# EasyEDA Pro project ProPrj_transverter-front-end_2026-04-14.epro, board PCB_PCB_inter-board-barrier
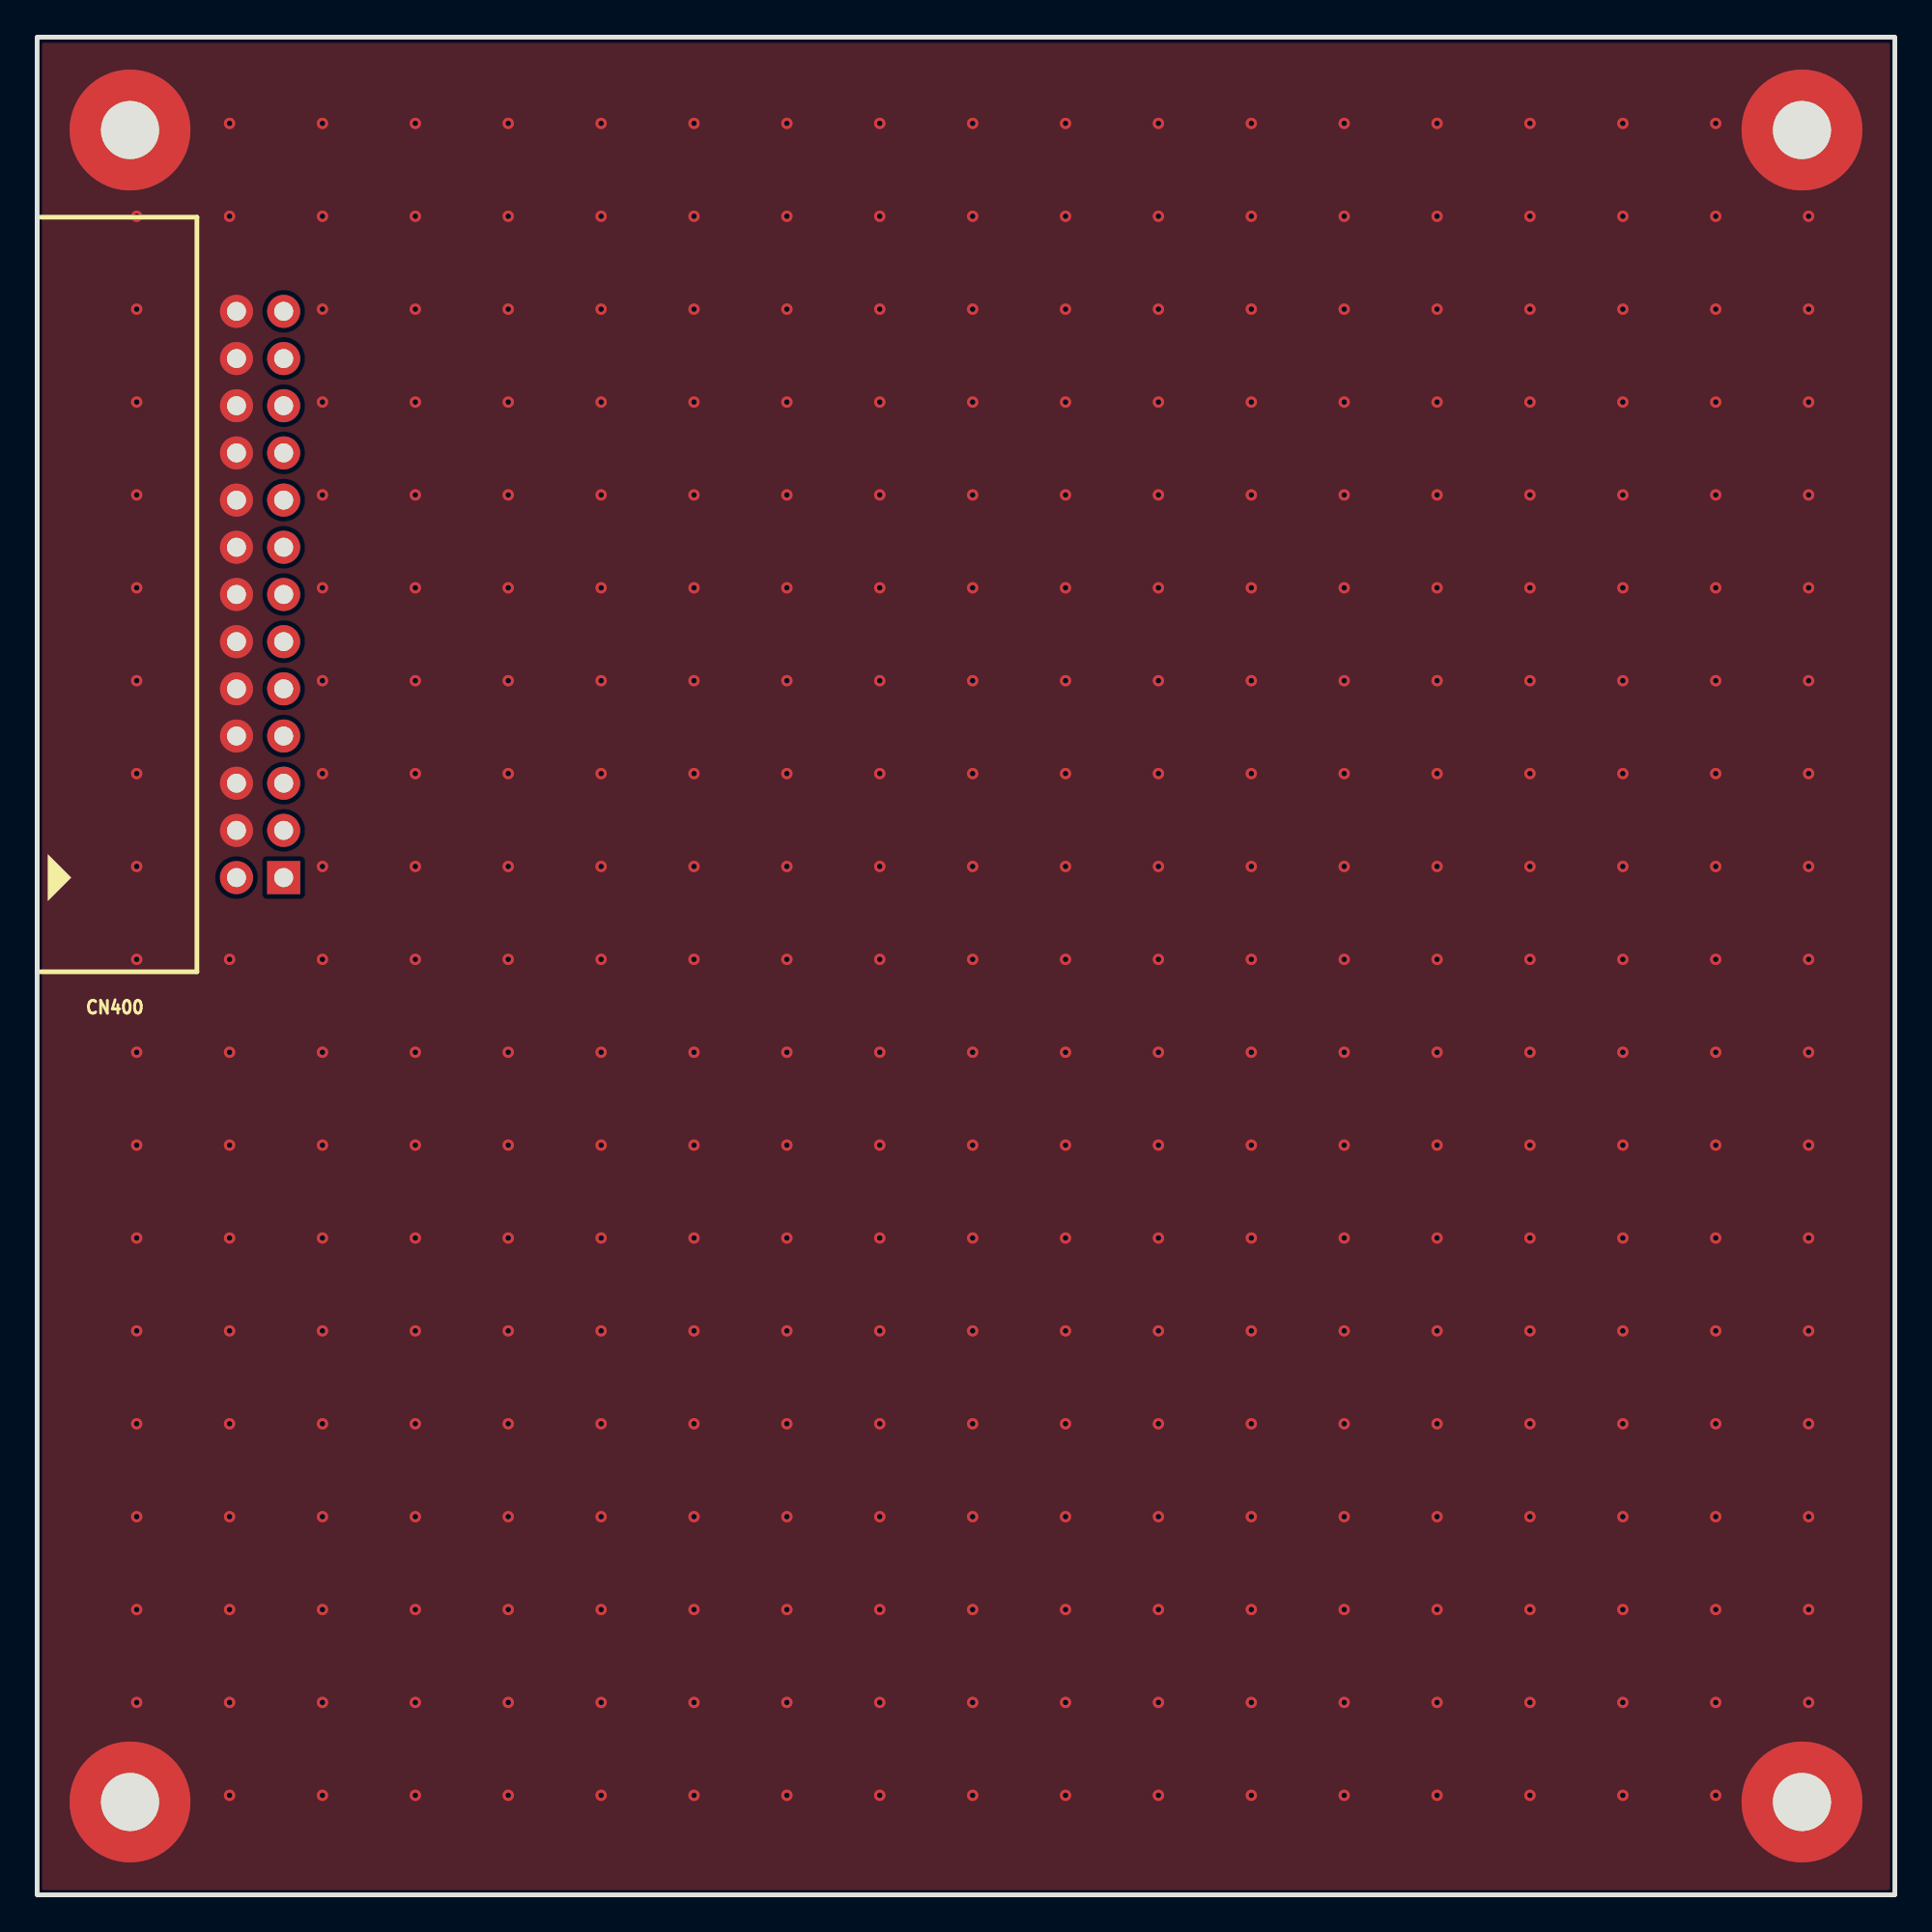
[diagram p13: board, top side]
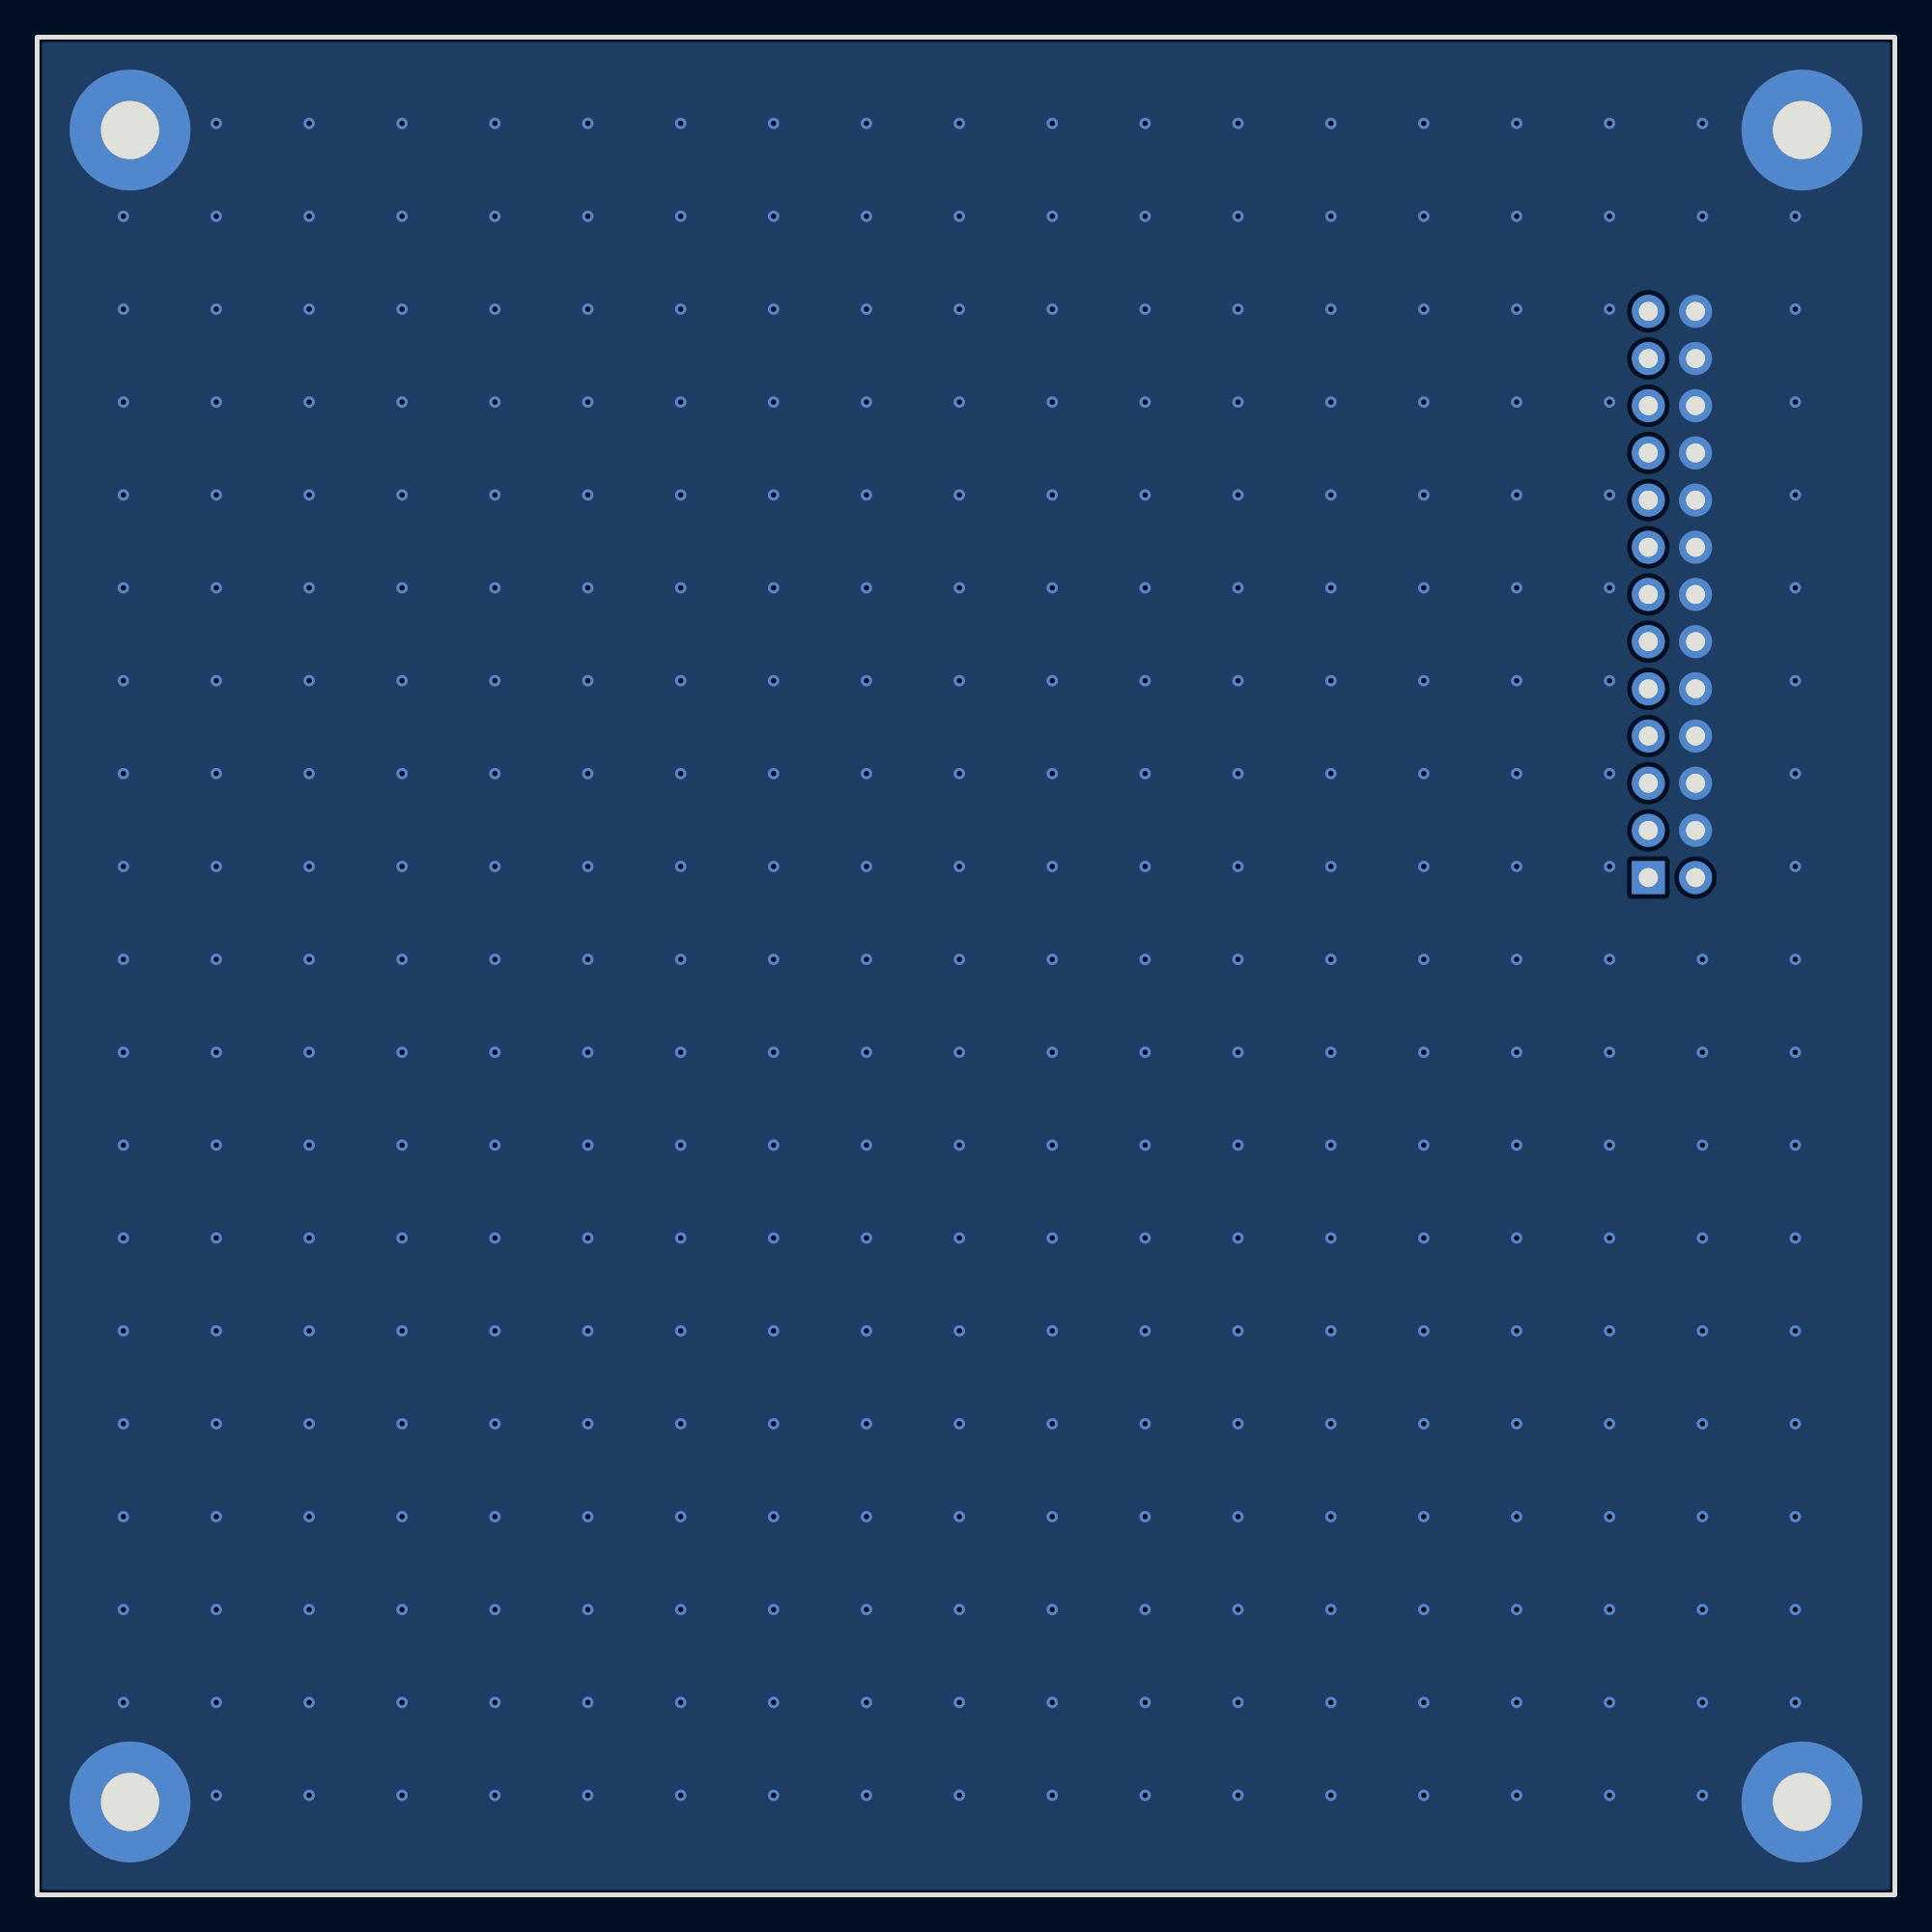
[diagram p14: board, bottom side, seen from below]

Outline 100 x 100 mm; copper layers: Top Layer, Bottom Layer. Coordinates in mm from the lower left corner of the outline.
Outline path: rectangle 0,100 100,0
Stack: Top Layer 0.035mm / Dielectric1 1.51mm FR4 er 4.5 / Bottom Layer 0.035mm

## Design rules (mm)
template: Custom Config
spacing copperThickness1oz (default): track to track 0.102, other pairs 0.152 to 0.3
spacing copperThickness2oz: track to track 0.203, other pairs 0.152 to 0.3
track width copperThickness1oz (default): min 0.127, default 0.254, max 2.54
track width copperThickness2oz: min 0.203, default 0.254, max 2.54
differential pair differentialPair (default): width min 0.127, default 0.254, max 2.54; gap min 0.152, default 0.152
via viaSize (default): diameter min 0.5, default 0.61, max 10; hole min 0.3, default 0.305, max 6.3
pour e5 uses copperRegion
pour e1 uses copperRegion

## Placement (name value [footprint] x y rotation side)
CN400  SBH11-PBPC-D13-RA-BK  [IDC-TH_26P-P2.54-H-M-R2-C13-W8.8]  12 70 270 top
NOREF  -  [Pad_e10]  5 5 0 top
NOREF#2  -  [Pad_e7]  5 95 0 top
NOREF#3  -  [Pad_e8]  95 95 0 top
NOREF#4  -  [Pad_e9]  95 5 0 top

## Footprints (pads in the part's own frame, mm; a bottom-side part is the same pattern mirrored in y, then rotated)
IDC-TH_26P-P2.54-H-M-R2-C13-W8.8
  rect 1.778x1.778 hole 1.02: 1(15.24,1.27)
  round 1.778 hole 1.02: 2(15.24,-1.27) 3(12.7,1.27) 4(12.7,-1.27) 5(10.16,1.27) 6(10.16,-1.27) 7(7.62,1.27) 8(7.62,-1.27) 9(5.08,1.27) 10(5.08,-1.27) 11(2.54,1.27) 12(2.54,-1.27) 13(0,1.27) 14(0,-1.27) 15(-2.54,1.27) 16(-2.54,-1.27) 17(-5.08,1.27) 18(-5.08,-1.27) 19(-7.62,1.27) 20(-7.62,-1.27) 21(-10.16,1.27) 22(-10.16,-1.27) 23(-12.7,1.27) 24(-12.7,-1.27) 25(-15.24,1.27) 26(-15.24,-1.27)
Pad_e7
  round 6.5 hole 3.125: 1(0,0)
Pad_e8
  round 6.5 hole 3.125: 2(0,0)
Pad_e9
  round 6.5 hole 3.125: 3(0,0)
Pad_e10
  round 6.5 hole 3.125: 4(0,0)

## Nets
GND: CN400.4 CN400.6 CN400.8 CN400.10 CN400.12 CN400.14 CN400.16 CN400.18 CN400.20 CN400.22 CN400.24 CN400.26 NOREF.4 NOREF#2.1 NOREF#3.2 NOREF#4.3

Pads without a net: CN400 1 2 3 5 7 9 11 13 15 17 19 21 23 25

## Via types
v1: diameter 0.61, hole 0.305, Top Layer to Bottom Layer, 350 vias

## Routing (per net, layer and track width the routed paths; a pad name or vN(x,y) marks a point on that pad's centre or on a via; arc(x,y) is an arc through that point)
GND:
  vias: v1(5.36,90.36) v1(5.36,85.36) v1(5.36,80.36) v1(5.36,75.36) v1(5.36,70.36) v1(5.36,65.36) v1(5.36,60.36) v1(5.36,55.36) v1(5.36,50.36) v1(5.36,45.36) v1(5.36,40.36) v1(5.36,35.36) v1(5.36,30.36) v1(5.36,25.36) v1(5.36,20.36) v1(5.36,15.36) v1(5.36,10.36) v1(10.36,95.36) v1(10.36,90.36) v1(10.36,50.36) v1(10.36,45.36) v1(10.36,40.36) v1(10.36,35.36) v1(10.36,30.36) v1(10.36,25.36) v1(10.36,20.36) v1(10.36,15.36) v1(10.36,10.36) v1(10.36,5.36) v1(15.36,95.36) v1(15.36,90.36) v1(15.36,85.36) v1(15.36,80.36) v1(15.36,75.36) v1(15.36,70.36) v1(15.36,65.36) v1(15.36,60.36) v1(15.36,55.36) v1(15.36,50.36) v1(15.36,45.36) v1(15.36,40.36) v1(15.36,35.36) v1(15.36,30.36) v1(15.36,25.36) v1(15.36,20.36) v1(15.36,15.36) v1(15.36,10.36) v1(15.36,5.36) v1(20.36,95.36) v1(20.36,90.36) v1(20.36,85.36) v1(20.36,80.36) v1(20.36,75.36) v1(20.36,70.36) v1(20.36,65.36) v1(20.36,60.36) v1(20.36,55.36) v1(20.36,50.36) v1(20.36,45.36) v1(20.36,40.36) v1(20.36,35.36) v1(20.36,30.36) v1(20.36,25.36) v1(20.36,20.36) v1(20.36,15.36) v1(20.36,10.36) v1(20.36,5.36) v1(25.36,95.36) v1(25.36,90.36) v1(25.36,85.36) v1(25.36,80.36) v1(25.36,75.36) v1(25.36,70.36) v1(25.36,65.36) v1(25.36,60.36) v1(25.36,55.36) v1(25.36,50.36) v1(25.36,45.36) v1(25.36,40.36) v1(25.36,35.36) v1(25.36,30.36) v1(25.36,25.36) v1(25.36,20.36) v1(25.36,15.36) v1(25.36,10.36) v1(25.36,5.36) v1(30.36,95.36) v1(30.36,90.36) v1(30.36,85.36) v1(30.36,80.36) v1(30.36,75.36) v1(30.36,70.36) v1(30.36,65.36) v1(30.36,60.36) v1(30.36,55.36) v1(30.36,50.36) v1(30.36,45.36) v1(30.36,40.36) v1(30.36,35.36) v1(30.36,30.36) v1(30.36,25.36) v1(30.36,20.36) v1(30.36,15.36) v1(30.36,10.36) v1(30.36,5.36) v1(35.36,95.36) v1(35.36,90.36) v1(35.36,85.36) v1(35.36,80.36) v1(35.36,75.36) v1(35.36,70.36) v1(35.36,65.36) v1(35.36,60.36) v1(35.36,55.36) v1(35.36,50.36) v1(35.36,45.36) v1(35.36,40.36) v1(35.36,35.36) v1(35.36,30.36) v1(35.36,25.36) v1(35.36,20.36) v1(35.36,15.36) v1(35.36,10.36) v1(35.36,5.36) v1(40.36,95.36) v1(40.36,90.36) v1(40.36,85.36) v1(40.36,80.36) v1(40.36,75.36) v1(40.36,70.36) v1(40.36,65.36) v1(40.36,60.36) v1(40.36,55.36) v1(40.36,50.36) v1(40.36,45.36) v1(40.36,40.36) v1(40.36,35.36) v1(40.36,30.36) v1(40.36,25.36) v1(40.36,20.36) v1(40.36,15.36) v1(40.36,10.36) v1(40.36,5.36) v1(45.36,95.36) v1(45.36,90.36) v1(45.36,85.36) v1(45.36,80.36) v1(45.36,75.36) v1(45.36,70.36) v1(45.36,65.36) v1(45.36,60.36) v1(45.36,55.36) v1(45.36,50.36) v1(45.36,45.36) v1(45.36,40.36) v1(45.36,35.36) v1(45.36,30.36) v1(45.36,25.36) v1(45.36,20.36) v1(45.36,15.36) v1(45.36,10.36) v1(45.36,5.36) v1(50.36,95.36) v1(50.36,90.36) v1(50.36,85.36) v1(50.36,80.36) v1(50.36,75.36) v1(50.36,70.36) v1(50.36,65.36) v1(50.36,60.36) v1(50.36,55.36) v1(50.36,50.36) v1(50.36,45.36) v1(50.36,40.36) v1(50.36,35.36) v1(50.36,30.36) v1(50.36,25.36) v1(50.36,20.36) v1(50.36,15.36) v1(50.36,10.36) v1(50.36,5.36) v1(55.36,95.36) v1(55.36,90.36) v1(55.36,85.36) v1(55.36,80.36) v1(55.36,75.36) v1(55.36,70.36) v1(55.36,65.36) v1(55.36,60.36) v1(55.36,55.36) v1(55.36,50.36) v1(55.36,45.36) v1(55.36,40.36) v1(55.36,35.36) v1(55.36,30.36) v1(55.36,25.36) v1(55.36,20.36) v1(55.36,15.36) v1(55.36,10.36) v1(55.36,5.36) v1(60.36,95.36) v1(60.36,90.36) v1(60.36,85.36) v1(60.36,80.36) v1(60.36,75.36) v1(60.36,70.36) v1(60.36,65.36) v1(60.36,60.36) v1(60.36,55.36) v1(60.36,50.36) v1(60.36,45.36) v1(60.36,40.36) v1(60.36,35.36) v1(60.36,30.36) v1(60.36,25.36) v1(60.36,20.36) v1(60.36,15.36) v1(60.36,10.36) v1(60.36,5.36) v1(65.36,95.36) v1(65.36,90.36) v1(65.36,85.36) v1(65.36,80.36) v1(65.36,75.36) v1(65.36,70.36) v1(65.36,65.36) v1(65.36,60.36) v1(65.36,55.36) v1(65.36,50.36) v1(65.36,45.36) v1(65.36,40.36) v1(65.36,35.36) v1(65.36,30.36) v1(65.36,25.36) v1(65.36,20.36) v1(65.36,15.36) v1(65.36,10.36) v1(65.36,5.36) v1(70.36,95.36) v1(70.36,90.36) v1(70.36,85.36) v1(70.36,80.36) v1(70.36,75.36) v1(70.36,70.36) v1(70.36,65.36) v1(70.36,60.36) v1(70.36,55.36) v1(70.36,50.36) v1(70.36,45.36) v1(70.36,40.36) v1(70.36,35.36) v1(70.36,30.36) v1(70.36,25.36) v1(70.36,20.36) v1(70.36,15.36) v1(70.36,10.36) v1(70.36,5.36) v1(75.36,95.36) v1(75.36,90.36) v1(75.36,85.36) v1(75.36,80.36) v1(75.36,75.36) v1(75.36,70.36) v1(75.36,65.36) v1(75.36,60.36) v1(75.36,55.36) v1(75.36,50.36) v1(75.36,45.36) v1(75.36,40.36) v1(75.36,35.36) v1(75.36,30.36) v1(75.36,25.36) v1(75.36,20.36) v1(75.36,15.36) v1(75.36,10.36) v1(75.36,5.36) v1(80.36,95.36) v1(80.36,90.36) v1(80.36,85.36) v1(80.36,80.36) v1(80.36,75.36) v1(80.36,70.36) v1(80.36,65.36) v1(80.36,60.36) v1(80.36,55.36) v1(80.36,50.36) v1(80.36,45.36) v1(80.36,40.36) v1(80.36,35.36) v1(80.36,30.36) v1(80.36,25.36) v1(80.36,20.36) v1(80.36,15.36) v1(80.36,10.36) v1(80.36,5.36) v1(85.36,95.36) v1(85.36,90.36) v1(85.36,85.36) v1(85.36,80.36) v1(85.36,75.36) v1(85.36,70.36) v1(85.36,65.36) v1(85.36,60.36) v1(85.36,55.36) v1(85.36,50.36) v1(85.36,45.36) v1(85.36,40.36) v1(85.36,35.36) v1(85.36,30.36) v1(85.36,25.36) v1(85.36,20.36) v1(85.36,15.36) v1(85.36,10.36) v1(85.36,5.36) v1(90.36,95.36) v1(90.36,90.36) v1(90.36,85.36) v1(90.36,80.36) v1(90.36,75.36) v1(90.36,70.36) v1(90.36,65.36) v1(90.36,60.36) v1(90.36,55.36) v1(90.36,50.36) v1(90.36,45.36) v1(90.36,40.36) v1(90.36,35.36) v1(90.36,30.36) v1(90.36,25.36) v1(90.36,20.36) v1(90.36,15.36) v1(90.36,10.36) v1(90.36,5.36) v1(95.36,90.36) v1(95.36,85.36) v1(95.36,80.36) v1(95.36,75.36) v1(95.36,70.36) v1(95.36,65.36) v1(95.36,60.36) v1(95.36,55.36) v1(95.36,50.36) v1(95.36,45.36) v1(95.36,40.36) v1(95.36,35.36) v1(95.36,30.36) v1(95.36,25.36) v1(95.36,20.36) v1(95.36,15.36) v1(95.36,10.36)

## Copper pours and planes (outline as drawn; the poured copper is in the pictures)
GND on Top Layer: 0,99.69 100,99.69 100,0 0,0
GND on Bottom Layer: 0,100 100,100 100,0 0,0
